# Altium schematic sheet GoodBoy_V1_nRF9160dk_MCU_Bluetooth.SchDoc
size A3
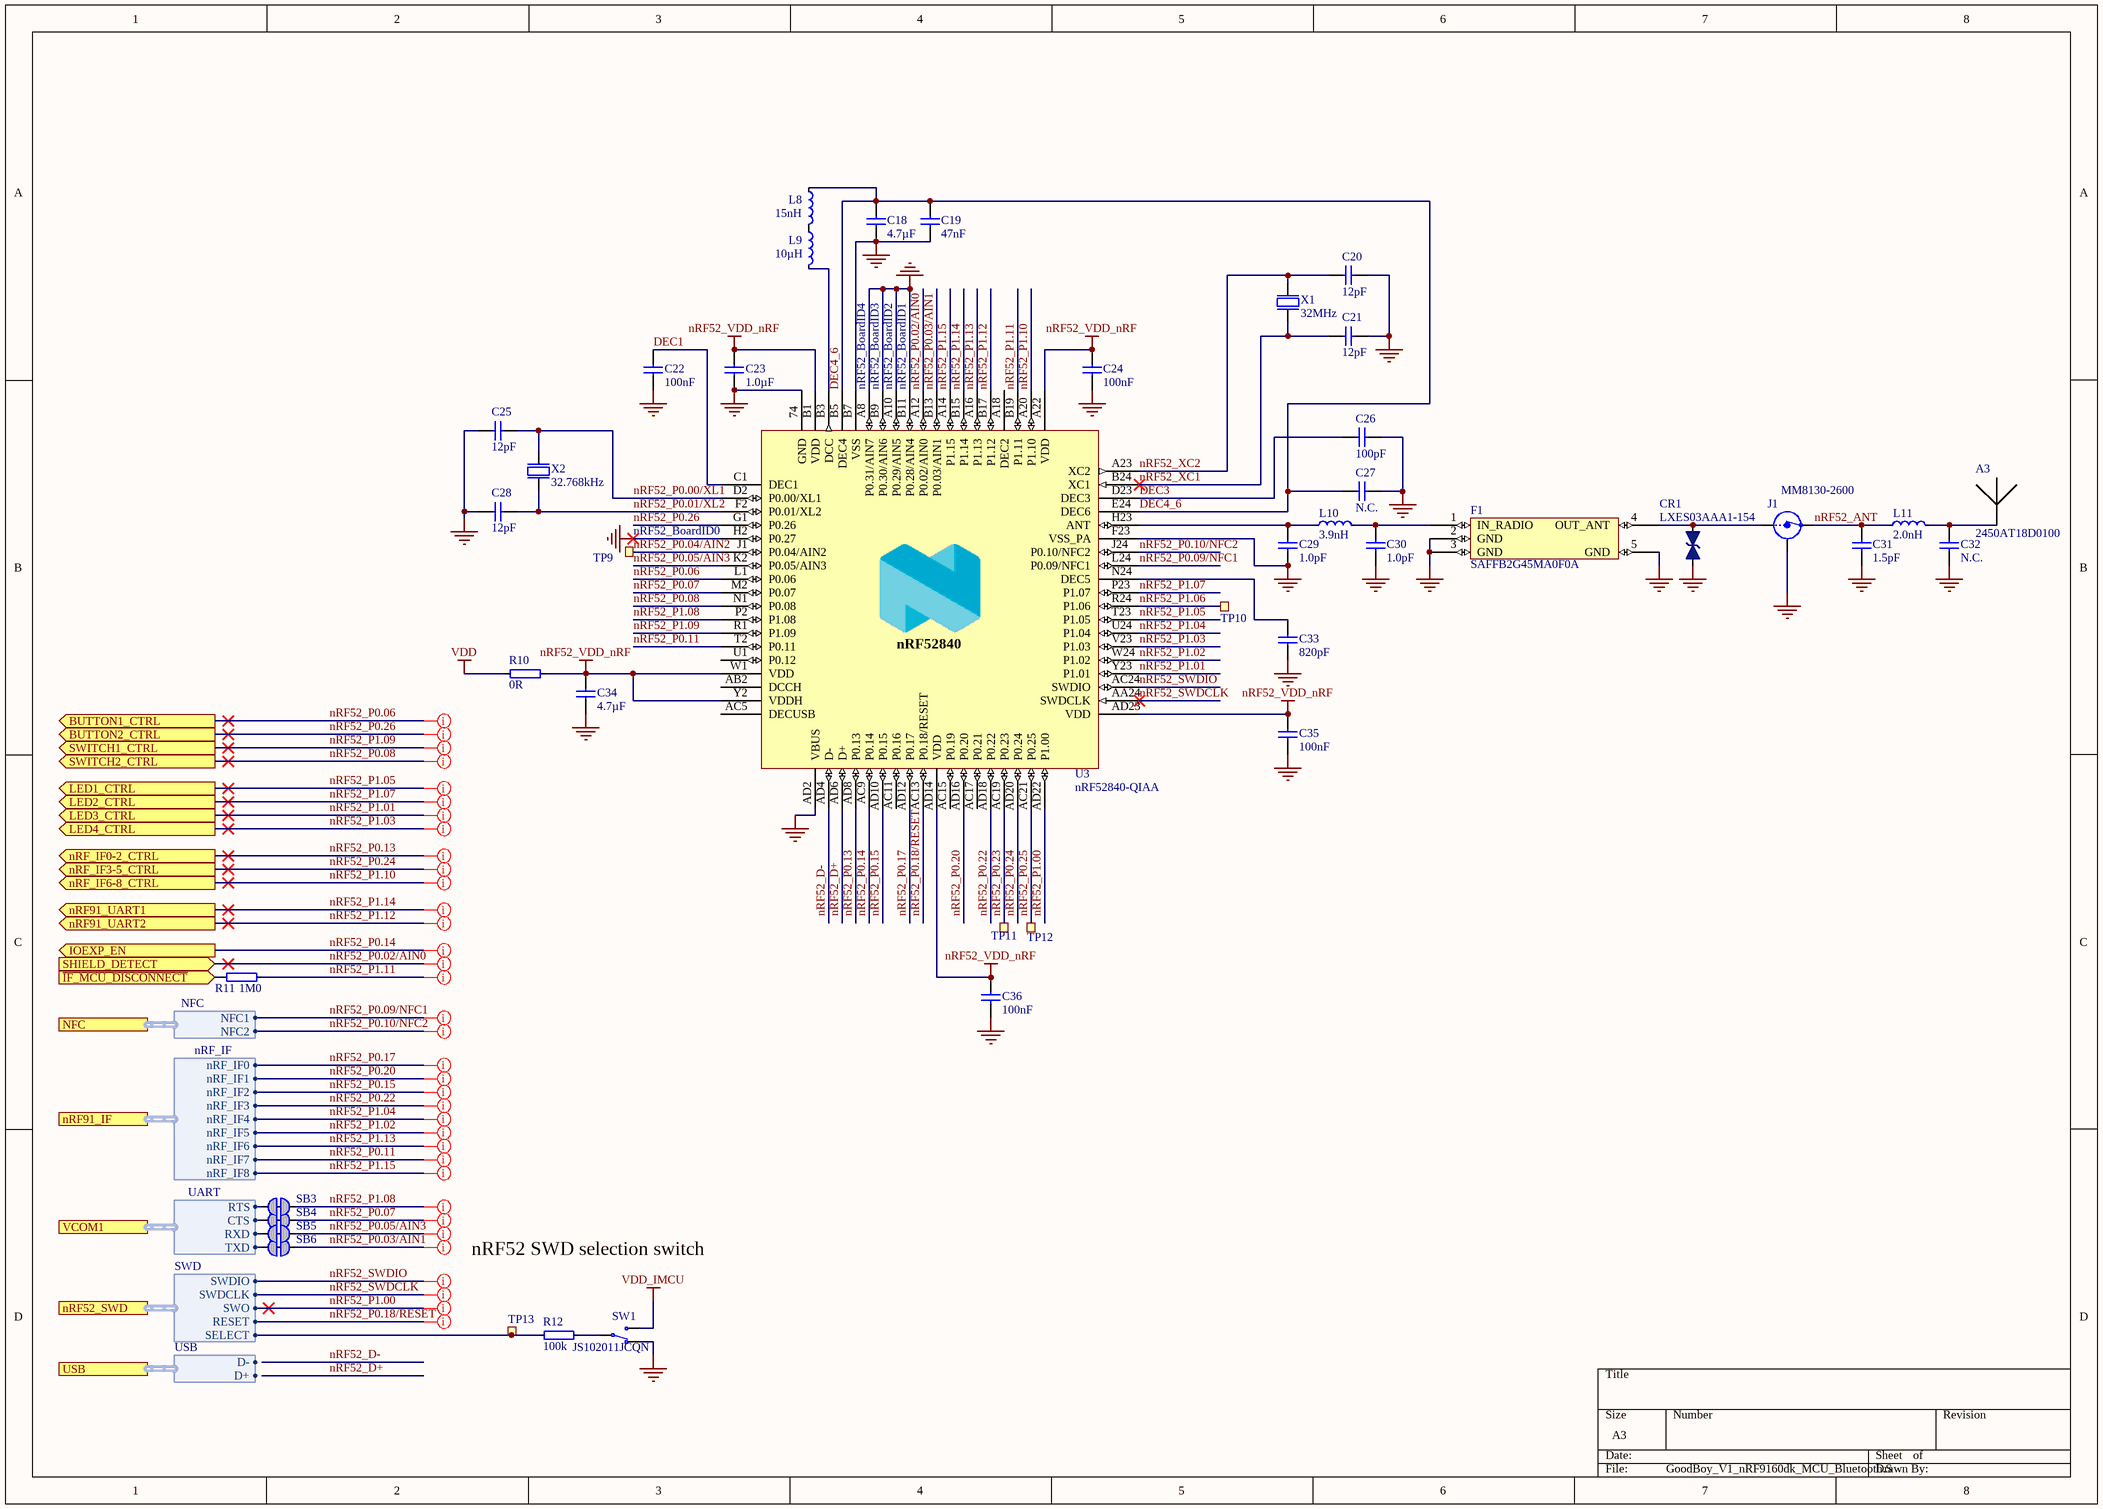
[diagram p0: GoodBoy_V1_nRF9160dk_MCU_Bluetooth.SchDoc]

## Parts
A3  2450AT18D0100  [2450AT18D0100_STD-L]
C18  4.7µF  [CAPC1005X04L]
C19  47nF  [CAPC0603X03L_C]
C20  12pF  [CAPC0603X03L_C]
C21  12pF  [CAPC0603X03L_C]
C22  100nF  [CAPC0603X03L_C]
C23  1.0µF  [CAPC1005X04L]
C24  100nF  [CAPC0603X03L_C]
C25  12pF  [CAPC0603X03L_C]
C26  100pF  [CAPC0603X03L_C]
C27  N.C.  [CAPC0603X03L_C]
C28  12pF  [CAPC0603X03L_C]
C29  1.0pF  [CAPC0603X03L_C]
C30  1.0pF  [CAPC0603X03L_C]
C31  1.5pF  [CAPC0603X03L_C]
C32  N.C.  [CAPC0603X03L_C]
C33  820pF  [CAPC0603X03L_C]
C34  4.7µF  [CAPC1608X06L]
C35  100nF  [CAPC0603X03L_C]
C36  100nF  [CAPC0603X03L_C]
CR1  LXES03AAA1-154  [LXES03AAA1-154]
F1  SAFFB2G45MA0F0A  [SAFFB2G45MA0F0A]
J1  MM8130-2600  [COAXIAL-SWF]
L8  15nH  [INDC1005X04L]
L9  10µH  [INDC1608X06L]
L10  3.9nH  [INDC0603X03L_C]
L11  2.0nH  [INDC0603X03L_C]
R10  0R  [RESC0603X03L_C]
R11  1M0  [RESC0603X03L_C]
R12  100k  [RESC0603X03L_C]
SB3  Solderbridge  [Solderbridge_Shorted]  (value not drawn)  (net tie, no BOM)
SB4  Solderbridge  [Solderbridge_Shorted]  (value not drawn)  (net tie, no BOM)
SB5  Solderbridge  [Solderbridge_Shorted]  (value not drawn)  (net tie, no BOM)
SB6  Solderbridge  [Solderbridge_Shorted]  (value not drawn)  (net tie, no BOM)
SW1  JS102011JCQN  [JS102011JCQN]
TP9  Ø1.5mm,SMD  [TP_SMD_Ø1.5mm]  (value not drawn)  (no BOM)
TP10  Ø1.5mm,SMD  [TP_SMD_Ø1.5mm]  (value not drawn)  (no BOM)
TP11  Ø1.5mm,SMD  [TP_SMD_Ø1.5mm]  (value not drawn)  (no BOM)
TP12  Ø1.5mm,SMD  [TP_SMD_Ø1.5mm]  (value not drawn)  (no BOM)
TP13  Ø1.5mm,SMD  [TP_SMD_Ø1.5mm]  (value not drawn)  (no BOM)
U3  nRF52840-QIAA  [AQFN50P700X700X85_HS-74N]
X1  32MHz  [BT-XTAL_2016]
X2  32.768kHz  [XTAL_3215]

## Ports
BUTTON1_CTRL (out), BUTTON2_CTRL (out), IOEXP_EN (out), LED1_CTRL (out), LED2_CTRL (out), LED3_CTRL (out), LED4_CTRL (out), NFC (harness NFC), nRF52_SWD (harness SWD), nRF91_IF (harness nRF_IF), nRF91_UART1 (out), nRF91_UART2 (out), nRF_IF0-2_CTRL (out), nRF_IF3-5_CTRL (out), nRF_IF6-8_CTRL (out), SHIELD_DETECT (in), SWITCH1_CTRL (out), SWITCH2_CTRL (out), USB (harness USB), VCOM1 (harness UART), ~{IF_MCU_DISCONNECT} (in)

## Harnesses
nRF_IF: nRF_IF0, nRF_IF1, nRF_IF2, nRF_IF3, nRF_IF4, nRF_IF5, nRF_IF6, nRF_IF7, nRF_IF8
UART: RTS, CTS, RXD, TXD
NFC: NFC1, NFC2
SWD: SWDIO, SWDCLK, SWO, RESET, SELECT
USB: D+, D-

## Nets
GND: A3.2(GND) C18.1 C19.1 C20.2 C21.2 C22.1 C23.1 C24.1 C25.1 C26.2 C27.1 C28.2 C29.1 C30.1 C31.2 C32.1 C33.1 C34.1 C35.1 C36.1 CR1.1 F1.2(GND) F1.3(GND) F1.5(GND) J1.2(Shield) SW1.1(N.C) U3.74(GND) U3.A8(P0.31/AIN7) U3.A10(P0.29/AIN5) U3.AD2(VBUS) U3.B7(VSS) U3.B9(P0.30/AIN6) U3.B11(P0.28/AIN4) U3.F23(VSS_PA) U3.H2(P0.27) X1.2(GND) X1.4(GND)
nRF52_VDD_nRF: C23.2 C24.2 C34.2 C35.2 C36.2 R10.2 U3.A22(VDD) U3.AD14(VDD) U3.AD23(VDD) U3.B1(VDD) U3.W1(VDD) U3.Y2(VDDH)
VDD: R10.1
VDD_IMCU: SW1.3(N.O)
DEC1: C22.2 U3.C1(DEC1)
DEC3: C26.1 U3.D23(DEC3)
DEC4_6: C18.2 C19.2 C27.2 L8.1 U3.B5(DEC4) U3.E24(DEC6)
~{IF_MCU_DISCONNECT}: R11.2 ; port ~{IF_MCU_DISCONNECT}
nRF52_ANT: C31.1 J1.3(OUT) L11.1
nRF52_D+: U3.AD6(D+)
nRF52_D-: U3.AD4(D-)
nRF52_P0.00/XL1: C25.2 U3.D2(P0.00/XL1) X2.1(inp)
nRF52_P0.01/XL2: C28.1 U3.F2(P0.01/XL2) X2.2(out)
nRF52_P0.02/AIN0: U3.A12(P0.02/AIN0) ; port SHIELD_DETECT
nRF52_P0.03/AIN1: SB6.1 U3.B13(P0.03/AIN1)
nRF52_P0.04/AIN2: TP9.1 U3.J1(P0.04/AIN2)
nRF52_P0.05/AIN3: SB5.1 U3.K2(P0.05/AIN3)
nRF52_P0.06: U3.L1(P0.06) ; port BUTTON1_CTRL
nRF52_P0.07: SB4.1 U3.M2(P0.07)
nRF52_P0.08: U3.N1(P0.08) ; port SWITCH2_CTRL
nRF52_P0.09/NFC1: U3.L24(P0.09/NFC1) ; port NFC.NFC1
nRF52_P0.10/NFC2: U3.J24(P0.10/NFC2) ; port NFC.NFC2
nRF52_P0.11: U3.T2(P0.11) ; port nRF91_IF.nRF_IF7
nRF52_P0.13: U3.AD8(P0.13) ; port nRF_IF0-2_CTRL
nRF52_P0.14: U3.AC9(P0.14) ; port IOEXP_EN
nRF52_P0.15: U3.AD10(P0.15) ; port nRF91_IF.nRF_IF2
nRF52_P0.17: U3.AD12(P0.17) ; port nRF91_IF.nRF_IF0
nRF52_P0.18/RESET: U3.AC13(P0.18/RESET) ; port nRF52_SWD.RESET
nRF52_P0.20: U3.AD16(P0.20) ; port nRF91_IF.nRF_IF1
nRF52_P0.22: U3.AD18(P0.22) ; port nRF91_IF.nRF_IF3
nRF52_P0.23: TP11.1 U3.AC19(P0.23)
nRF52_P0.24: U3.AD20(P0.24) ; port nRF_IF3-5_CTRL
nRF52_P0.25: TP12.1 U3.AC21(P0.25)
nRF52_P0.26: U3.G1(P0.26) ; port BUTTON2_CTRL
nRF52_P1.00: U3.AD22(P1.00) ; port nRF52_SWD.SWO
nRF52_P1.01: U3.Y23(P1.01) ; port LED3_CTRL
nRF52_P1.02: U3.W24(P1.02) ; port nRF91_IF.nRF_IF5
nRF52_P1.03: U3.V23(P1.03) ; port LED4_CTRL
nRF52_P1.04: U3.U24(P1.04) ; port nRF91_IF.nRF_IF4
nRF52_P1.05: U3.T23(P1.05) ; port LED1_CTRL
nRF52_P1.06: TP10.1 U3.R24(P1.06)
nRF52_P1.07: U3.P23(P1.07) ; port LED2_CTRL
nRF52_P1.08: SB3.1 U3.P2(P1.08)
nRF52_P1.09: U3.R1(P1.09) ; port SWITCH1_CTRL
nRF52_P1.10: U3.A20(P1.10) ; port nRF_IF6-8_CTRL
nRF52_P1.11: R11.1 U3.B19(P1.11)
nRF52_P1.12: U3.B17(P1.12) ; port nRF91_UART2
nRF52_P1.13: U3.A16(P1.13) ; port nRF91_IF.nRF_IF6
nRF52_P1.14: U3.B15(P1.14) ; port nRF91_UART1
nRF52_P1.15: U3.A14(P1.15) ; port nRF91_IF.nRF_IF8
nRF52_SWDCLK: U3.AA24(SWDCLK) ; port nRF52_SWD.SWDCLK
nRF52_SWDIO: U3.AC24(SWDIO) ; port nRF52_SWD.SWDIO
nRF52_XC1: C21.1 U3.B24(XC1) X1.1(inp)
nRF52_XC2: C20.1 U3.A23(XC2) X1.3(out)
NetA3_1: A3.1 C32.2 L11.2
NetC29_2: C29.2 L10.1 U3.H23(ANT)
NetC30_2: C30.2 F1.1(IN_RADIO) L10.2
NetC33_2: C33.2 U3.N24(DEC5)
NetCR1_2: CR1.2 F1.4(OUT_ANT) J1.1(IN)
NetL8_2: L8.2 L9.1
NetL9_2: L9.2 U3.B3(DCC)
NetR12_1: R12.1 SW1.2(COM)
NetR12_2: R12.2 TP13.1 ; port nRF52_SWD.SELECT
NetSB3_2: SB3.2 ; port VCOM1.RTS
NetSB4_2: SB4.2 ; port VCOM1.CTS
NetSB5_2: SB5.2 ; port VCOM1.RXD
NetSB6_2: SB6.2 ; port VCOM1.TXD

Not connected (* = marked no-connect by the designer): U3 A18(DEC2) AB2(DCCH) AC5(DECUSB) AC11(P0.16) AC15(P0.19) AC17(P0.21) U1(P0.12)

## Layout directives
net class GPIO: nRF52_P0.02/AIN0, nRF52_P0.03/AIN1, nRF52_P0.05/AIN3, nRF52_P0.06, nRF52_P0.07, nRF52_P0.08, nRF52_P0.09/NFC1, nRF52_P0.10/NFC2, nRF52_P0.11, nRF52_P0.13, nRF52_P0.14, nRF52_P0.15, nRF52_P0.17, nRF52_P0.20, nRF52_P0.22, nRF52_P0.24, nRF52_P0.26, nRF52_P1.01, nRF52_P1.02, nRF52_P1.03, nRF52_P1.04, nRF52_P1.05, nRF52_P1.07, nRF52_P1.08, nRF52_P1.09, nRF52_P1.10, nRF52_P1.11, nRF52_P1.12, nRF52_P1.13, nRF52_P1.14, nRF52_P1.15
net class SWD: nRF52_P0.18/RESET, nRF52_P1.00, nRF52_SWDCLK, nRF52_SWDIO

## Notes on the sheet
- nRF52_BoardID4
- (near U3) nRF52_BoardID3
- (near U3) nRF52_BoardID2
- (near U3) nRF52_BoardID1
- (near TP9) nRF52_BoardID0
- nRF52 SWD selection switch
- (in symbol nRF52840-QIAAD0) nRF52840

## Library data of the parts
A3 = Antenna with GND: 2.45 GHz chip antenna; Part Number: Johanson 2450AT18D0100_STD-L; Manufacturer: Johanson Technology; Part number IPS: 00000001415; Artikkelnr Noca: 53059035; Manufacturer Part Number: 2450AT18D0100; ComponentLink1URL: *; ComponentLink1Description: Datasheet; ComponentLink2URL: *; ComponentLink2Description: Supplier link; HelpURL: http://www.johansontechnology.com/datasheets/antennas/2450AT18D0100.pdf; Footprint Doc: 2450AT18D0100; LatestRevisionDate: 2016-06-02; Pin Count: 4; Publisher: Nordic Semiconductor; Published: 2016-01-12; Value: 2450AT18D0100; Note: *; Supplier 1: Digi-Key; Supplier Part Number 1: 2450AT18D0100E; Supplier 2: Mouser; Supplier Part Number 2: 609-2450AT18D0100E
C18 = CAP: Capacitor, X5R, ±20%; Part Number: C0402-4µ7; Part number IPS: 00000001251; Note: 10V; Artikkelnr Noca: 20039482; Manufacturer: *; Manufacturer Part Number: *; ComponentLink1URL: *; ComponentLink1Description: Datasheet; ComponentLink2URL: *; ComponentLink2Description: Supplier link; HelpURL: *; Footprint Doc: 0402; LatestRevisionDate: 2017-11-09; Pin Count: 2; Publisher: Nordic Semiconductor; Published: 2009-05-08; Value: 4.7µF; Supplier 1: Digi-Key; Supplier Part Number 1: 490-13252-1-ND; Supplier 2: *; Supplier Part Number 2: *
C19 = CAP: Capacitor, X5R, ±10%; Part Number: C0201-47n; Part number IPS: 00000001250; Note: 10V; Artikkelnr Noca: N.A.; Manufacturer: *; Manufacturer Part Number: *; ComponentLink1URL: *; ComponentLink1Description: Datasheet; ComponentLink2URL: *; ComponentLink2Description: Supplier link; HelpURL: *; Footprint Doc: 0201; LatestRevisionDate: 2017-11-09; Pin Count: 2; Publisher: Nordic Semiconductor; Published: 2014-11-13; Value: 47nF; Supplier 1: *; Supplier Part Number 1: *; Supplier 2: *; Supplier Part Number 2: *
C20 C21 = CAP: Capacitor, NP0, ±2%; Part Number: C0201-12p; Part number IPS: 00000007848; Note: 25V; Artikkelnr Noca: N.A.; Manufacturer: *; Manufacturer Part Number: *; ComponentLink1URL: *; ComponentLink1Description: Datasheet; ComponentLink2URL: *; ComponentLink2Description: Supplier link; HelpURL: *; Footprint Doc: 0201; LatestRevisionDate: 2017-11-09; Pin Count: 2; Publisher: Nordic Semiconductor; Published: 2014-11-13; Value: 12pF; Supplier 1: *; Supplier Part Number 1: *; Supplier 2: *; Supplier Part Number 2: *
C22 = CAP: Capacitor, X5R, ±10%; Part Number: C0201-100n; Part number IPS: 00000001248; Note: 16V; Artikkelnr Noca: N.A.; Manufacturer: *; Manufacturer Part Number: *; ComponentLink1URL: *; ComponentLink1Description: Datasheet; ComponentLink2URL: *; ComponentLink2Description: Supplier link; HelpURL: *; Footprint Doc: 0201; LatestRevisionDate: 2017-11-09; Pin Count: 2; Publisher: Nordic Semiconductor; Published: 2014-11-13; Value: 100nF; Supplier 1: *; Supplier Part Number 1: *; Supplier 2: *; Supplier Part Number 2: *
C23 = C0402-1µ0: Capacitor, X5R, ±5%, 6.3V; Part number IPS: 00000007786; Artikkelnr Noca: 20039235; Part Number: C0402-1µ0; Manufacturer: *; Manufacturer Part Number: *; ComponentLink1URL: *; ComponentLink1Description: Datasheet; ComponentLink2URL: *; ComponentLink2Description: Supplier link; HelpURL: *; Footprint Doc: 0402; LatestRevisionDate: 2016-08-22; Pin Count: 2; Publisher: Nordic Semiconductor; Published: 2009-05-08; Value: 1.0µF; Note: 6.3V; Supplier 1: Digi-Key; Supplier Part Number 1: 1276-1444-1-ND; Supplier 2: *; Supplier Part Number 2: *
C24 C35 C36 = C0201-100n: Capacitor, X5R, ±10%; Part number IPS: 00000001248; Note: 16V; Artikkelnr Noca: N.A.; Part Number: C0201-100n; Manufacturer: *; Manufacturer Part Number: *; ComponentLink1URL: *; ComponentLink1Description: Datasheet; ComponentLink2URL: *; ComponentLink2Description: Supplier link; HelpURL: *; Footprint Doc: 0201; LatestRevisionDate: 2017-11-09; Pin Count: 2; Publisher: Nordic Semiconductor; Published: 2014-11-13; Value: 100nF; Supplier 1: *; Supplier Part Number 1: *; Supplier 2: *; Supplier Part Number 2: *
C25 C28 = C0201-12p: Capacitor, NP0, ±2%; Part number IPS: 00000007848; Note: 25V; Artikkelnr Noca: N.A.; Part Number: C0201-12p; Manufacturer: *; Manufacturer Part Number: *; ComponentLink1URL: *; ComponentLink1Description: Datasheet; ComponentLink2URL: *; ComponentLink2Description: Supplier link; HelpURL: *; Footprint Doc: 0201; LatestRevisionDate: 2017-11-09; Pin Count: 2; Publisher: Nordic Semiconductor; Published: 2014-11-13; Value: 12pF; Supplier 1: *; Supplier Part Number 1: *; Supplier 2: *; Supplier Part Number 2: *
C26 = C0201-100p: Capacitor, NP0, ±2%, 25V; Part number IPS: 00000007853; Artikkelnr Noca: N.A.; Part Number: C0201-100p; Manufacturer: *; Manufacturer Part Number: *; ComponentLink1URL: *; ComponentLink1Description: Datasheet; ComponentLink2URL: *; ComponentLink2Description: Supplier link; HelpURL: *; Footprint Doc: 0201; LatestRevisionDate: 2017-11-09; Pin Count: 2; Publisher: Nordic Semiconductor; Published: 2014-11-13; Value: 100pF; Note: 25V; Supplier 1: *; Supplier Part Number 1: *; Supplier 2: *; Supplier Part Number 2: *
C27 C32 = C0201-N.C.: Not mounted; Note: Chip Cap; Artikkelnr Noca: N.A.; Assembly: Not mounted; Part Number: C0201-N.C.; Manufacturer: *; Manufacturer Part Number: *; ComponentLink1URL: *; ComponentLink1Description: Datasheet; ComponentLink2URL: *; ComponentLink2Description: Supplier link; HelpURL: *; Footprint Doc: 0201; LatestRevisionDate: 2014-11-13; Pin Count: 2; Publisher: Nordic Semiconductor; Published: 2014-11-13; Value: N.C.; Part number IPS: N.A.; Supplier 1: *; Supplier Part Number 1: *; Supplier 2: *; Supplier Part Number 2: *
C29 C30 = C0201-1.0p: Capacitor, NP0, ±0.05pF, 50V; Part number IPS: 00000001247; Artikkelnr Noca: N.A.; Part Number: C0201-1.0p; Manufacturer: *; Manufacturer Part Number: *; ComponentLink1URL: *; ComponentLink1Description: Datasheet; ComponentLink2URL: *; ComponentLink2Description: Supplier link; HelpURL: *; Footprint Doc: 0201; LatestRevisionDate: 2018-10-22; Pin Count: 2; Publisher: Nordic Semiconductor; Published: 2014-11-13; Value: 1.0pF; Note: 50V; Supplier 1: *; Supplier Part Number 1: *; Supplier 2: *; Supplier Part Number 2: *
C31 = C0201-1.5p: Capacitor, NP0, ±0.1pF; Part number IPS: 00000007107; Note: 50V; Artikkelnr Noca: N.A.; Part Number: C0201-1.5p; Manufacturer: *; Manufacturer Part Number: *; ComponentLink1URL: *; ComponentLink1Description: Datasheet; ComponentLink2URL: *; ComponentLink2Description: Supplier link; HelpURL: *; Footprint Doc: 0201; LatestRevisionDate: 2017-11-09; Pin Count: 2; Publisher: Nordic Semiconductor; Published: 2014-11-13; Value: 1.5pF; Supplier 1: *; Supplier Part Number 1: *; Supplier 2: *; Supplier Part Number 2: *
C33 = C0201-820p: Capacitor, X7R, ±10%; Part number IPS: 00000001249; Note: 25V; Artikkelnr Noca: N.A.; Part Number: C0201-820p; Manufacturer: *; Manufacturer Part Number: *; ComponentLink1URL: *; ComponentLink1Description: Datasheet; ComponentLink2URL: *; ComponentLink2Description: Supplier link; HelpURL: *; Footprint Doc: 0201; LatestRevisionDate: 2017-11-09; Pin Count: 2; Publisher: Nordic Semiconductor; Published: 2014-11-13; Value: 820pF; Supplier 1: *; Supplier Part Number 1: *; Supplier 2: *; Supplier Part Number 2: *
C34 = C0603-4µ7: Capacitor, X5R, ±10%; Part number IPS: 00000007783; Note: 6.3V; Artikkelnr Noca: 20069060; Part Number: C0603-4µ7; Manufacturer: *; Manufacturer Part Number: *; ComponentLink1URL: *; ComponentLink1Description: Datasheet; ComponentLink2URL: *; ComponentLink2Description: Supplier link; HelpURL: *; Footprint Doc: 0603; LatestRevisionDate: 2009-11-23; Pin Count: 2; Publisher: Nordic Semiconductor; Published: 2009-05-08; Value: 4.7µF; Supplier 1: *; Supplier Part Number 1: *; Supplier 2: *; Supplier Part Number 2: *
CR1 = LXES03AAA1-154: TVS DIODE 4V 0201; Manufacturer: Murata; Part number IPS: 00000001782; Artikkelnr Noca: N.A.; Part Number: LXES03AAA1-154; Manufacturer Part Number: LXES03AAA1-154; ComponentLink1URL: https://www.murata.com/en-us/products/productdata/8796832759838/CRESD-E.pdf; ComponentLink1Description: Datasheet; ComponentLink2URL: *; ComponentLink2Description: Supplier link; HelpURL: *; Footprint Doc: 0201; LatestRevisionDate: 2018-06-13; Pin Count: 2; Publisher: Nordic Semiconductor; Published: 2018-06-13; Value: LXES03AAA1-154; Note: *; Supplier 1: Digi-Key; Supplier Part Number 1: 490-14310-1-ND; Supplier 2: Mouser; Supplier Part Number 2: 81-LXES03AAA1-154
F1 = SAFFB2G45MA0F0A: 2.4 GHz BPF; Manufacturer: MuRata; Part number IPS: 00000001784; Artikkelnr Noca: N.A.; Part Number: SAFFB2G45MA0F0A; Manufacturer Part Number: SAFFB2G45MA0F0A; ComponentLink1URL: *; ComponentLink1Description: Datasheet; ComponentLink2URL: *; ComponentLink2Description: Supplier link; HelpURL: *; Footprint Doc: 1109; LatestRevisionDate: 2018-05-15; Pin Count: 5; Publisher: Nordic Semiconductor; Published: 2018-05-15; Value: SAFFB2G45MA0F0A; Supplier 1: *; Supplier Part Number 1: *; Supplier 2: *; Supplier Part Number 2: *
J1 = MM8130-2600: Coaxial Connector with Switch; Manufacturer: Murata; Part number IPS: 00000009955; Artikkelnr Noca: 55029011; Part Number: MM8130-2600; Manufacturer Part Number: MM8130-2600; LatestRevisionDate: 2014-04-24; Pin Count: 3; Publisher: Nordic Semiconductor; Published: 2014-04-24; Value: MM8130-2600; Note: *; Footprint Doc: COAXIAL-SWF; ComponentLink1URL: *; ComponentLink1Description: Datasheet; ComponentLink2URL: *; ComponentLink2Description: Supplier link; HelpURL: http://www.murata.com/products/catalog/pdf/o33e.pdf; Supplier 1: Digi-Key; Supplier Part Number 1: 490-4981-1-ND; Supplier 2: Mouser; Supplier Part Number 2: 81-MM8130-2600RA2
L8 = L0402-15n: Inductor, 320mA, ±5%; Manufacturer: Taiyo Yuden; Manufacturer Part Number: HK100515NJ-T; Part number IPS: 00000001262; Note: High frequency chip inductor ±10%; Artikkelnr Noca: 33029323; Part Number: L0402-15n; LatestRevisionDate: 2012-09-19; Pin Count: 2; Publisher: Nordic Semiconductor; Published: 2010-07-12; Value: 15nH; Footprint Doc: 0402; ComponentLink1Description: Datasheet; ComponentLink2Description: Supplier link; ComponentLink1URL: *; ComponentLink2URL: *; HelpURL: http://www.yuden.co.jp/productdata/catalog/en/mlci04_e.pdf; Supplier 1: Digi-Key; Supplier Part Number 1: 587-1521-1-ND; Supplier 2: Farnell; Supplier Part Number 2: 658-1328
L9 = L0603-10µ: Inductor, 80mA, ±10%; Manufacturer: Taiyo Yuden; Manufacturer Part Number: LBMF1608T100K; Part number IPS: 00000007794; Note: LBMF1608T100K 10µH 80mA 0603; Artikkelnr Noca: 33029314; Part Number: L0603-10µ; LatestRevisionDate: 2012-09-19; Pin Count: 2; Publisher: Nordic Semiconductor; Published: 2010-02-24; Value: 10µH; Footprint Doc: 0603; ComponentLink1Description: Datasheet; ComponentLink2Description: Supplier link; ComponentLink1URL: *; ComponentLink2URL: *; HelpURL: http://www.yuden.co.jp/ut/product/pdf/elb2_e.pdf; Supplier 1: Digi-Key; Supplier Part Number 1: 587-1714-1-ND; Supplier 2: Farnell; Supplier Part Number 2: 178-6105
L10 = L0201-3n9: Inductor, 400mA, ±0.1nH; Manufacturer: Murata; Manufacturer Part Number: LQP03TN3N9B02D; Part number IPS: 00000001253; Artikkelnr Noca: N.A.; Part Number: L0201-3n9; ComponentLink1URL: *; ComponentLink1Description: Datasheet; ComponentLink2Description: Supplier link; HelpURL: *; Footprint Doc: 0201; LatestRevisionDate: 2017-11-09; Pin Count: 2; Publisher: Nordic Semiconductor; Published: 2013-04-10; Value: 3.9nH; Note: *; ComponentLink2URL: *; Supplier 1: *; Supplier Part Number 1: *; Supplier 2: *; Supplier Part Number 2: *
L11 = L0201-2n0: Chip Inductor; Manufacturer: Murata; Manufacturer Part Number: LQP03TN2N0B02D; Part number IPS: 00000001670; Note: High frequency chip inductor ±5%; Artikkelnr Noca: N.A.; Part Number: L0201-2n0; ComponentLink1URL: *; ComponentLink1Description: Datasheet; ComponentLink2URL: *; ComponentLink2Description: Supplier link; HelpURL: http://www.murata.com/~/media/webrenewal/support/library/catalog/products/inductor/chip/o05e.ashx; Footprint Doc: 0201; LatestRevisionDate: 2016-04-19; Pin Count: 2; Publisher: Nordic Semiconductor; Published: 2016-04-19; Value: 2.0nH; Supplier 1: Digi-Key; Supplier Part Number 1: 490-12983-1-ND; Supplier 2: *; Supplier Part Number 2: *
R10 = R0201-0R: Resistor, ±5%, 0.05W; Part number IPS: 00000003245; Note: Chip Res 5%; Artikkelnr Noca: N.A.; Part Number: R0201-0R; Manufacturer: *; Manufacturer Part Number: *; ComponentLink1URL: *; ComponentLink1Description: Datasheet; ComponentLink2URL: *; ComponentLink2Description: Supplier link; HelpURL: *; Footprint Doc: 0201; LatestRevisionDate: 2017-11-09; Pin Count: 2; Publisher: Nordic Semiconductor; Published: 2014-11-13; Value: 0R; Supplier 1: *; Supplier Part Number 1: *; Supplier 2: *; Supplier Part Number 2: *
R11 = R0201-1M0: Resistor, ±1%, 0.05W; Part number IPS: 00000001418; Note: Chip Res 1%; Artikkelnr Noca: N.A.; Part Number: R0201-1M0; Manufacturer: *; Manufacturer Part Number: *; ComponentLink1URL: *; ComponentLink1Description: Datasheet; ComponentLink2URL: *; ComponentLink2Description: Supplier link; HelpURL: *; Footprint Doc: 0201; LatestRevisionDate: 2014-11-13; Pin Count: 2; Publisher: Nordic Semiconductor; Published: 2014-11-13; Value: 1M0; Supplier 1: *; Supplier Part Number 1: *; Supplier 2: *; Supplier Part Number 2: *
R12 = R0201-100k: Resistor, ±1%, 0.05W; Part number IPS: 00000001419; Note: Chip Res 1%; Artikkelnr Noca: N.A.; Part Number: R0201-100k; Manufacturer: *; Manufacturer Part Number: *; ComponentLink1URL: *; ComponentLink1Description: Datasheet; ComponentLink2URL: *; ComponentLink2Description: Supplier link; HelpURL: *; Footprint Doc: 0201; LatestRevisionDate: 2014-11-13; Pin Count: 2; Publisher: Nordic Semiconductor; Published: 2014-11-13; Value: 100k; Supplier 1: *; Supplier Part Number 1: *; Supplier 2: *; Supplier Part Number 2: *
SB3-SB6 = Solderbridge Shorted: Shorted Solderbridge; Artikkelnr Noca: N.A.; Part Number: Solderbridge Shorted; Manufacturer: *; Manufacturer Part Number: *; Footprint Doc: Solderbridge_Shorted; LatestRevisionDate: 2012-08-07; Pin Count: 2; Publisher: Nordic Semiconductor; Published: 2012-08-07; Value: Solderbridge; Note: *; Part number IPS: N.A.; ComponentLink1URL: *; ComponentLink1Description: Datasheet; ComponentLink2URL: *; ComponentLink2Description: Supplier link; HelpURL: *; Supplier 1: *; Supplier Part Number 1: *; Supplier 2: *; Supplier Part Number 2: *
SW1 = JS102011JCQN: SWITCH SLIDE SPDT 300MA 6V; Manufacturer: C&K Components; Part number IPS: 00000009980; Artikkelnr Noca: N.A.; Part Number: JS102011JCQN; Manufacturer Part Number: JS102011JCQN; LatestRevisionDate: 2017-02-15; Pin Count: 3; Publisher: Nordic Semiconductor; Published: 2017-02-15; Value: JS102011JCQN; Note: *; ComponentLink1URL: *; ComponentLink1Description: Datasheet; ComponentLink2URL: *; ComponentLink2Description: Supplier link; HelpURL: http://www.ckswitches.com/media/1422/js.pdf; Footprint Doc: *; Supplier 1: Digi-Key; Supplier Part Number 1: CKN10721CT-ND; Supplier 2: Mouser; Supplier Part Number 2: 611-JS102011JCQN
TP9-TP13 = TP_SMD_Ø1.5MM: 1.0mm circular SMD testpad; Manufacturer: Nordic Semiconductor; Artikkelnr Noca: N.A.; Part Number: TP_SMD_Ø1.5MM; Manufacturer Part Number: *; ComponentLink1URL: *; ComponentLink1Description: Datasheet; ComponentLink2URL: *; ComponentLink2Description: Supplier link; HelpURL: *; Footprint Doc: TP_SMD_Ø1.5mm; LatestRevisionDate: 2016-06-02; Pin Count: 1; Publisher: Nordic Semiconductor; Published: 2016-06-02; Value: Ø1.5mm,SMD; Note: *; Part number IPS: N.A.; Supplier 1: *; Supplier Part Number 1: *; Supplier 2: *; Supplier Part Number 2: *
U3 = nRF52840-QIAAD0: Multi-protocol Bluetooth Low Energy, IEEE 802.15.4, ANT and 2.4GHz proprietary system-on-chip; Manufacturer: Nordic Semiconductor; Artikkelnr Noca: N.A.; Part Number: nRF52840-QIAAD0; Manufacturer Part Number: nRF52840-QIAAD0; LatestRevisionDate: 2018-12-04; Pin Count: 73; Publisher: Nordic Semiconductor; Published: 2018-12-04; Value: nRF52840-QIAA; Note: *; Footprint Doc: AQFN-73; Part number IPS: N.A.; ComponentLink1URL: *; ComponentLink1Description: Datasheet; ComponentLink2URL: *; ComponentLink2Description: Supplier link; HelpURL: *; Supplier 1: Nordic Semiconductor; Supplier Part Number 1: nRF52840-QIAAD0; Supplier 2: *; Supplier Part Number 2: *
X1 = XTAL_SMD2016_32MHz_8pF_Golledge: XTAL SMD 2016, 32MHz, Cl=8pF, Tol: ±10ppm, Stab: ±15ppm; Manufacturer Part Number: MP06003; Part number IPS: 00000001431; Note: XTAL SMD 32.000MHz; Artikkelnr Noca: 22010050; Part Number: XTAL_SMD2016_32MHz_8pF_Golledge; LatestRevisionDate: 2016-11-02; Pin Count: 4; Publisher: Nordic Semiconductor; Published: 2016-11-02; Value: 32MHz; Footprint Doc: XTAL_2016; Manufacturer: Golledge; ComponentLink1URL: *; ComponentLink1Description: Datasheet; ComponentLink2URL: *; ComponentLink2Description: Supplier link; HelpURL: \\hizz\pro\app9717\Datasheet\crystals\Golledge\mp06003.pdf; Supplier 1: Link Nordic; Supplier Part Number 1: *; Supplier 2: *; Supplier Part Number 2: *
X2 = XTAL_SMD3215_32.768kHz_9pF_NDK: XTAL SMD 3215, 32.768kHz, 9pF, ±20ppm; Manufacturer: NDK; Manufacturer Part Number: NX3215SA-32.768K-STD-MUA-9; Part number IPS: 00000005419; Note: XTAL SMD 32.768kHz; Artikkelnr Noca: 22010049; Part Number: XTAL_SMD3215_32.768kHz_9pF_NDK; LatestRevisionDate: 2017-10-23; Pin Count: 2; Publisher: Nordic Semiconductor; Published: 2017-10-23; Value: 32.768kHz; Footprint Doc: XTAL_3215; ComponentLink1URL: *; ComponentLink1Description: Datasheet; ComponentLink2URL: *; ComponentLink2Description: Supplier link; HelpURL: *; Supplier 1: *; Supplier Part Number 1: *; Supplier 2: *; Supplier Part Number 2: *